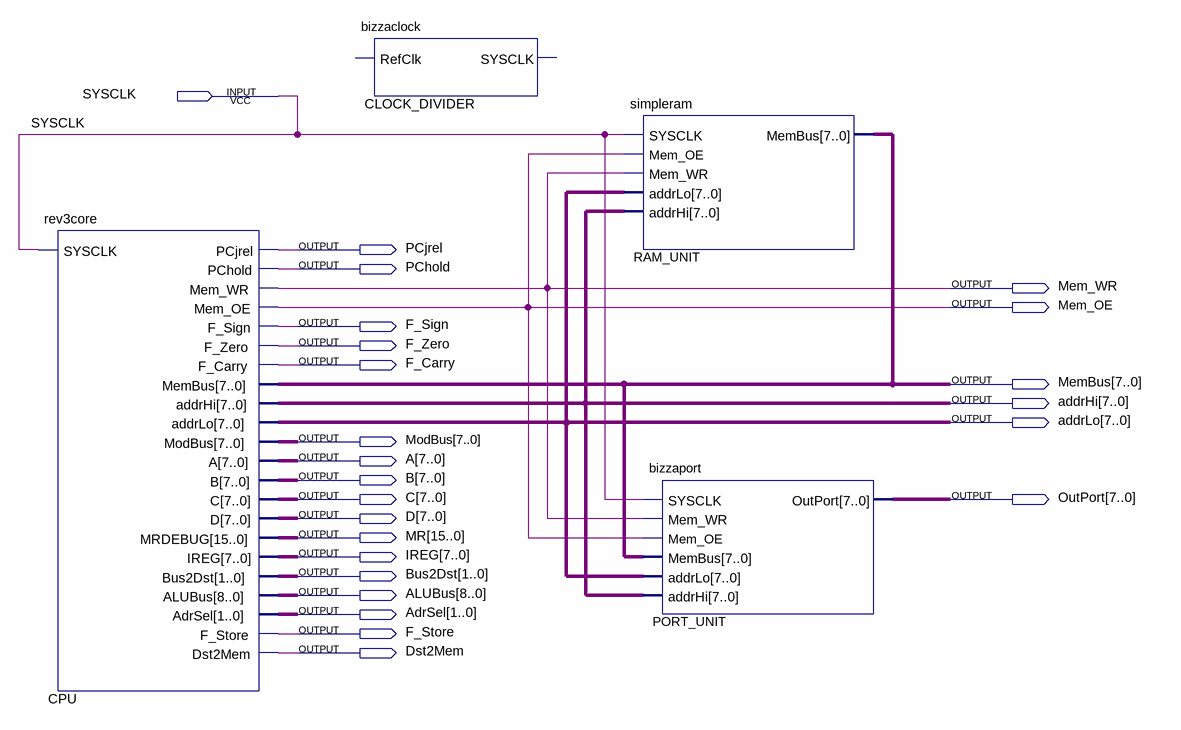
[diagram p0: schematic sheet]
// Quartus schematic system.bdf as structural Verilog: 4 symbols, 24 pins
module system (
  input  SYSCLK,
  output PCjrel,
  output PChold,
  output Mem_WR,
  output Mem_OE,
  output F_Sign,
  output F_Zero,
  output F_Carry,
  output [7:0] MemBus,
  output [7:0] addrHi,
  output [7:0] addrLo,
  output [7:0] ModBus,
  output [7:0] A,
  output [7:0] B,
  output [7:0] C,
  output [7:0] OutPort,
  output [7:0] D,
  output [15:0] MR,
  output [7:0] IREG,
  output [1:0] Bus2Dst,
  output [8:0] ALUBus,
  output [1:0] AdrSel,
  output F_Store,
  output Dst2Mem
);

  rev3core CPU (
    .SYSCLK(SYSCLK), .PCjrel(PCjrel), .PChold(PChold), .Mem_WR(Mem_WR), .Mem_OE(Mem_OE), .F_Sign(F_Sign),
    .F_Zero(F_Zero), .F_Carry(F_Carry), .MemBus(MemBus), .addrHi(addrHi), .addrLo(addrLo), .ModBus(ModBus),
    .A(A), .B(B), .C(C), .D(D), .MRDEBUG(MR), .IREG(IREG), .Bus2Dst(Bus2Dst), .ALUBus(ALUBus),
    .AdrSel(AdrSel), .F_Store(F_Store), .Dst2Mem(Dst2Mem));
  bizzaclock CLOCK_DIVIDER ();  // open: RefClk, SYSCLK
  simpleram RAM_UNIT (
    .SYSCLK(SYSCLK), .Mem_OE(Mem_OE), .Mem_WR(Mem_WR), .addrLo(addrLo), .addrHi(addrHi), .MemBus(MemBus));
  bizzaport PORT_UNIT (
    .SYSCLK(SYSCLK), .Mem_WR(Mem_WR), .Mem_OE(Mem_OE), .MemBus(MemBus), .addrLo(addrLo), .addrHi(addrHi),
    .OutPort(OutPort));
endmodule
